# Altium project RUT2CLOUDPrjPcb.PrjPcb (part 2 of 2)

## Sheet BLE_Controller.SchDoc
size A3
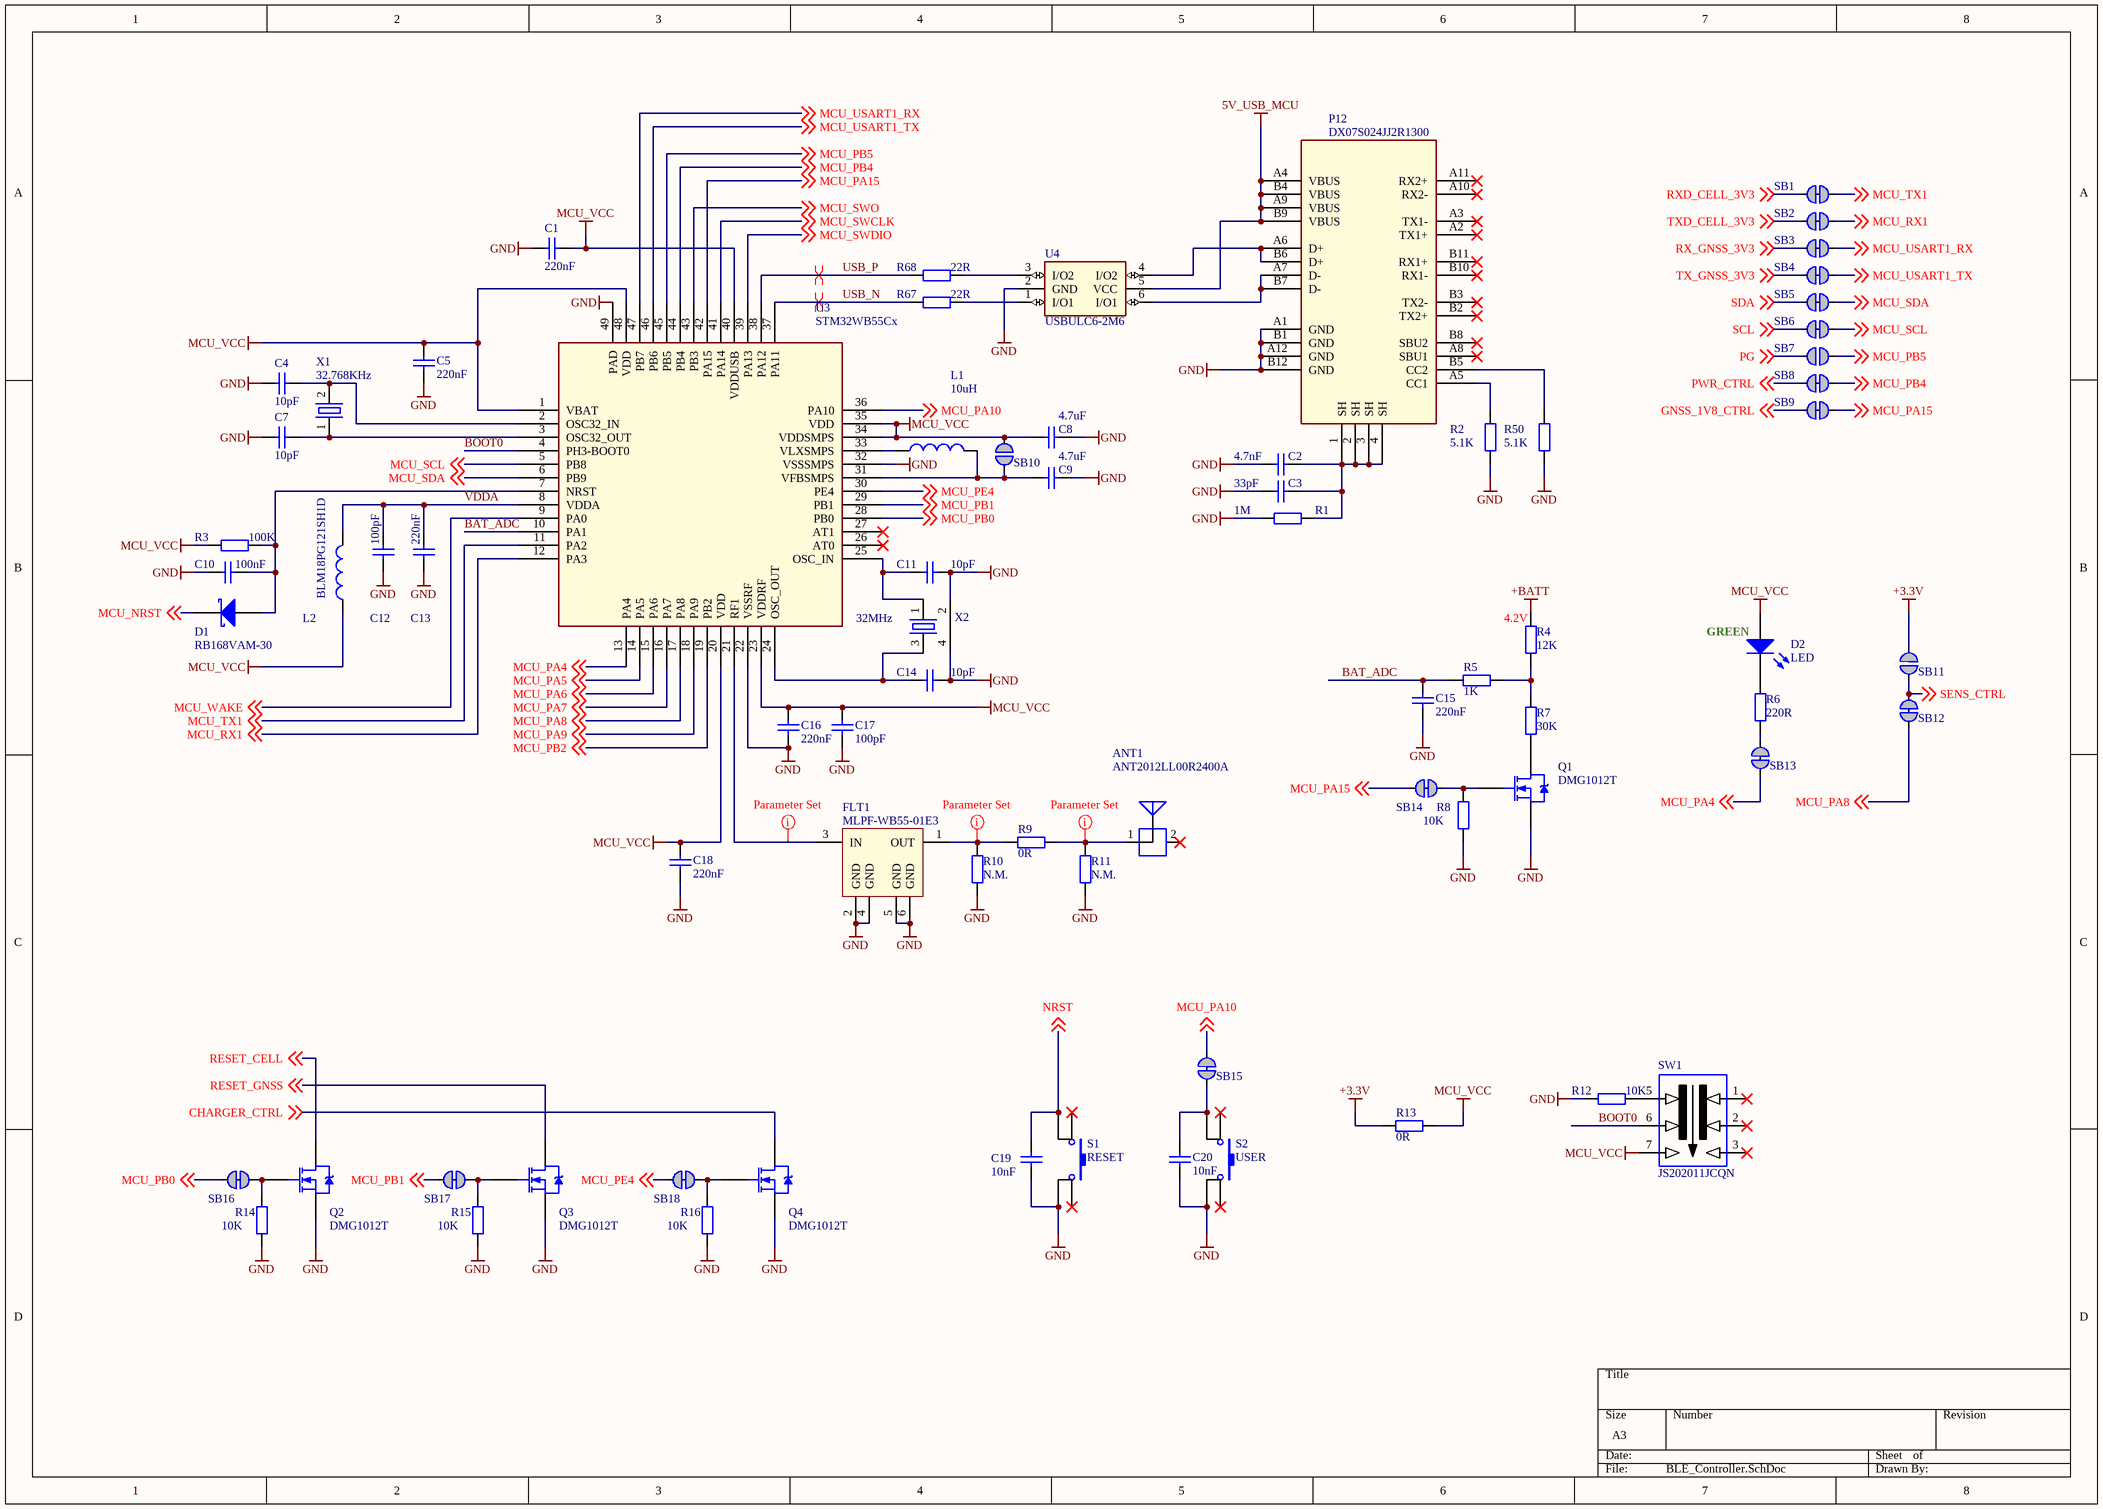
[diagram p5: BLE_Controller.SchDoc]

### Parts
ANT1  ANT2012LL00R2400A  [YEGEO_BT_Antena_0805]
C1  value 220nF  [C0402]  (hidden comment: Cap Semi)
C2  value 4.7nF  [C0402]  (hidden comment: Cap Semi)
C3  value 33pF  [C0402]  (hidden comment: Cap Semi)
C4  value 10pF  [C0402]  (hidden comment: Cap Semi)
C5  value 220nF  [C0402]  (hidden comment: Cap Semi)
C7  value 10pF  [C0402]  (hidden comment: Cap Semi)
C8  value 4.7uF  [C0402]  (hidden comment: Cap Semi)
C9  value 4.7uF  [C0402]  (hidden comment: Cap Semi)
C10  value 100nF  [C0402]  (hidden comment: Cap Semi)
C11  value 10pF  [C0402]  (hidden comment: Cap Semi)
C12  value 100pF  [C0402]  (hidden comment: Cap Semi)
C13  value 220nF  [C0402]  (hidden comment: Cap Semi)
C14  value 10pF  [C0402]  (hidden comment: Cap Semi)
C15  value 220nF  [C0402]  (hidden comment: Cap Semi)
C16  value 220nF  [C0402]  (hidden comment: Cap Semi)
C17  value 100pF  [C0402]  (hidden comment: Cap Semi)
C18  value 220nF  [C0402]  (hidden comment: Cap Semi)
C19  value 10nF  [C0402]  (hidden comment: Cap Semi)
C20  value 10nF  [C0402]  (hidden comment: Cap Semi)
D1  RB168VAM-30  [SOD323]
D2  LED  [PICOLED]
FLT1  MLPF-WB55-01E3  [Bumpless CSP]
L1  value 10uH  [L0805]  (hidden comment: Inductor)
L2  value BLM18PG121SH1D  [L0603]  (hidden comment: Inductor)
P12  DX07S024JJ2R1300  [DX07_USB_C]
Q1  DMG1012T  [SOT-523_custom]
Q2  DMG1012T  [SOT-523_custom]
Q3  DMG1012T  [SOT-523_custom]
Q4  DMG1012T  [SOT-523_custom]
R1  value 1M  [R0402]  (hidden comment: Res2)
R2  value 5.1K  [R0402]  (hidden comment: Res2)
R3  value 100K  [R0402]  (hidden comment: Res2)
R4  value 12K  [R0402]  (hidden comment: Res2)
R5  value 1K  [R0402]  (hidden comment: Res2)
R6  value 220R  [R0402]  (hidden comment: Res2)
R7  value 30K  [R0402]  (hidden comment: Res2)
R8  value 10K  [R0402]  (hidden comment: Res2)
R9  value 0R  [R0402]  (hidden comment: Res2)
R10  value N.M.  [R0402]  (hidden comment: Res2)  (no BOM)
R11  value N.M.  [R0402]  (hidden comment: Res2)  (no BOM)
R12  value 10K  [R0402]  (hidden comment: Res2)
R13  value 0R  [R0402]  (hidden comment: Res2)
R14  value 10K  [R0402]  (hidden comment: Res2)
R15  value 10K  [R0402]  (hidden comment: Res2)
R16  value 10K  [R0402]  (hidden comment: Res2)
R50  value 5.1K  [R0402]  (hidden comment: Res2)
R67  value 22R  [R0402]  (hidden comment: Res2)
R68  value 22R  [R0402]  (hidden comment: Res2)
S1  RESET  [PTS645S_button]
S2  USER  [PTS645S_button]
SB1  Solderbridge  [Solderbridge_Shorted]  (value not drawn)  (net tie, no BOM)
SB2  Solderbridge  [Solderbridge_Shorted]  (value not drawn)  (net tie, no BOM)
SB3  Solderbridge  [Solderbridge_Shorted]  (value not drawn)  (net tie, no BOM)
SB4  Solderbridge  [Solderbridge_Shorted]  (value not drawn)  (net tie, no BOM)
SB5  Solderbridge  [Solderbridge_Shorted]  (value not drawn)  (net tie, no BOM)
SB6  Solderbridge  [Solderbridge_Shorted]  (value not drawn)  (net tie, no BOM)
SB7  Solderbridge  [Solderbridge]  (value not drawn)  (no BOM)
SB8  Solderbridge  [Solderbridge_Shorted]  (value not drawn)  (net tie, no BOM)
SB9  Solderbridge  [Solderbridge_Shorted]  (value not drawn)  (net tie, no BOM)
SB10  Solderbridge  [Solderbridge]  (value not drawn)  (no BOM)
SB11  Solderbridge  [Solderbridge]  (value not drawn)  (no BOM)
SB12  Solderbridge  [Solderbridge_Shorted]  (value not drawn)  (net tie, no BOM)
SB13  Solderbridge  [Solderbridge_Shorted]  (value not drawn)  (net tie, no BOM)
SB14  Solderbridge  [Solderbridge_Shorted]  (value not drawn)  (net tie, no BOM)
SB15  Solderbridge  [Solderbridge_Shorted]  (value not drawn)  (net tie, no BOM)
SB16  Solderbridge  [Solderbridge_Shorted]  (value not drawn)  (net tie, no BOM)
SB17  Solderbridge  [Solderbridge_Shorted]  (value not drawn)  (net tie, no BOM)
SB18  Solderbridge  [Solderbridge_Shorted]  (value not drawn)  (net tie, no BOM)
SW1  JS202011JCQN  [JS202011JCQN]
U3  STM32WB55Cx  [UFQFPN48]
U4  USBULC6-2M6  [Micro_QFN_6L]
X1  32.768KHz  [XTAL_3215]
X2  32MHz  [XTAL_3.5x2.5]

### Nets
5V_USB_MCU: P12.A4(VBUS) P12.A9(VBUS) P12.B4(VBUS) P12.B9(VBUS) U4.5(VCC)
+3.3V: R13.2 SB11.1
+BATT: R4.1
GND: C1.2 C2.1 C3.1 C4.1 C5.1 C7.2 C8.2 C9.2 C10.1 C11.2 C12.1 C13.1 C14.1 C15.2 C16.1 C17.1 C18.1 C19.1 C20.2 FLT1.2(GND) FLT1.4(GND) FLT1.5(GND) FLT1.6(GND) P12.A1(GND) P12.A12(GND) P12.B1(GND) P12.B12(GND) Q1.3(S) Q2.3(S) Q3.3(S) Q4.3(S) R1.1 R2.1 R8.1 R10.2 R11.2 R12.1 R14.1 R15.1 R16.1 R50.1 S1.4 S2.4 U3.22(VSSRF) U3.32(VSSSMPS) U3.49(PAD) U4.2(GND) X2.2 X2.4
MCU_VCC: C1.1 C5.2 C8.1 C16.2 C17.2 C18.2 D2.1(A) L2.1 R3.1 R13.1 SB10.2 SW1.7 U3.1(VBAT) U3.20(VDD) U3.23(VDDRF) U3.34(VDDSMPS) U3.35(VDD) U3.40(VDDUSB) U3.48(VDD)
BAT_ADC: C15.1 R5.1 U3.10(PA1)
BOOT0: SW1.6 U3.4(PH3-BOOT0)
CHARGER_CTRL: Q4.2(D) ; off-sheet CHARGER_CTRL
GNSS_1V8_CTRL: SB9.2 ; off-sheet GNSS_1V8_CTRL
MCU_NRST: D1.2(K) ; off-sheet MCU_NRST
MCU_PA4: SB13.2 U3.13(PA4) ; off-sheet MCU_PA4
MCU_PA5: U3.14(PA5) ; off-sheet MCU_PA5
MCU_PA6: U3.15(PA6) ; off-sheet MCU_PA6
MCU_PA7: U3.16(PA7) ; off-sheet MCU_PA7
MCU_PA8: SB12.1 U3.17(PA8) ; off-sheet MCU_PA8
MCU_PA9: U3.18(PA9) ; off-sheet MCU_PA9
MCU_PA10: SB15.1 U3.36(PA10) ; off-sheet MCU_PA10
MCU_PA15: SB9.1 SB14.2 U3.42(PA15) ; off-sheet MCU_PA15
MCU_PB0: SB16.2 U3.28(PB0) ; off-sheet MCU_PB0
MCU_PB1: SB17.2 U3.29(PB1) ; off-sheet MCU_PB1
MCU_PB2: U3.19(PB2) ; off-sheet MCU_PB2
MCU_PB4: SB8.1 U3.44(PB4) ; off-sheet MCU_PB4
MCU_PB5: SB7.2 U3.45(PB5) ; off-sheet MCU_PB5
MCU_PE4: SB18.2 U3.30(PE4) ; off-sheet MCU_PE4
MCU_RX1: SB2.1 U3.12(PA3) ; off-sheet MCU_RX1
MCU_SCL: SB6.1 U3.5(PB8) ; off-sheet MCU_SCL
MCU_SDA: SB5.1 U3.6(PB9) ; off-sheet MCU_SDA
MCU_SWCLK: U3.41(PA14) ; off-sheet MCU_SWCLK
MCU_SWDIO: U3.39(PA13) ; off-sheet MCU_SWDIO
MCU_SWO: U3.43(PB3) ; off-sheet MCU_SWO
MCU_TX1: SB1.1 U3.11(PA2) ; off-sheet MCU_TX1
MCU_USART1_RX: SB3.1 U3.47(PB7) ; off-sheet MCU_USART1_RX
MCU_USART1_TX: SB4.1 U3.46(PB6) ; off-sheet MCU_USART1_TX
MCU_WAKE: U3.9(PA0) ; off-sheet MCU_WAKE
NRST: C19.2 S1.2 ; off-sheet NRST
PG: SB7.1 ; off-sheet PG
PWR_CTRL: SB8.2 ; off-sheet PWR_CTRL
RESET_CELL: Q2.2(D) ; off-sheet RESET_CELL
RESET_GNSS: Q3.2(D) ; off-sheet RESET_GNSS
RX_GNSS_3V3: SB3.2 ; off-sheet RX_GNSS_3V3
RXD_CELL_3V3: SB1.2 ; off-sheet RXD_CELL_3V3
SCL: SB6.2 ; off-sheet SCL
SDA: SB5.2 ; off-sheet SDA
SENS_CTRL: SB11.2 SB12.2 ; off-sheet SENS_CTRL
TX_GNSS_3V3: SB4.2 ; off-sheet TX_GNSS_3V3
TXD_CELL_3V3: SB2.2 ; off-sheet TXD_CELL_3V3
USB_N: R67.2 U3.37(PA11)
USB_P: R68.2 U3.38(PA12)
VDDA: C12.2 C13.2 L2.2 U3.8(VDDA)
NetANT1_1: ANT1.1 R9.1 R11.1
NetC2_2: C2.2 C3.2 P12.1(SH) P12.2(SH) P12.3(SH) P12.4(SH) R1.2
NetC4_2: C4.2 U3.2(OSC32_IN) X1.2
NetC7_1: C7.1 U3.3(OSC32_OUT) X1.1
NetC9_1: C9.1 L1.2 SB10.1 U3.31(VFBSMPS)
NetC10_2: C10.2 D1.1(A) R3.2 U3.7(NRST)
NetC11_1: C11.1 U3.25(OSC_IN) X2.1
NetC14_2: C14.2 U3.24(OSC_OUT) X2.3
NetC20_1: C20.1 S2.2 SB15.2
NetD2_2: D2.2(K) R6.1
NetFLT1_1: FLT1.1(OUT) R9.2 R10.1
NetFLT1_3: FLT1.3(IN) U3.21(RF1)
NetL1_1: L1.1 U3.33(VLXSMPS)
NetP12_A5: P12.A5(CC1) R2.2
NetP12_A6: P12.A6(D+) P12.B6(D+) U4.4(I/O2)
NetP12_A7: P12.A7(D-) P12.B7(D-) U4.6(I/O1)
NetP12_B5: P12.B5(CC2) R50.2
NetQ1_1: Q1.1(G) R8.2 SB14.1
NetQ1_2: Q1.2(D) R7.2
NetQ2_1: Q2.1(G) R14.2 SB16.1
NetQ3_1: Q3.1(G) R15.2 SB17.1
NetQ4_1: Q4.1(G) R16.2 SB18.1
NetR4_2: R4.2 R5.2 R7.1
NetR6_2: R6.2 SB13.1
NetR12_2: R12.2 SW1.5
NetR67_1: R67.1 U4.1(I/O1)
NetR68_1: R68.1 U4.3(I/O2)

Not connected (* = marked no-connect by the designer): ANT1 2*; P12 A2(TX1+)* A3(TX1-)* A8(SBU1)* A10(RX2-)* A11(RX2+)* B2(TX2+)* B3(TX2-)* B8(SBU2)* B10(RX1-)* B11(RX1+)*; S1 1* 3*; S2 1* 3*; SW1 1* 2* 3*; U3 26(AT0)* 27(AT1)*

### Layout directives
differential pair: USB_N, USB_P
rule Clearance Constraint [Clearance = 0.106mm]; rule Width Constraint [Pref Width = 0.45mm    Min Width = 0.45mm    Max Width = 4mm]: NetANT1_1, NetFLT1_1
rule Clearance Constraint [Clearance = 0.104mm]; rule Width Constraint [Pref Width = 0.2mm    Min Width = 0.2mm    Max Width = 0.2mm]: NetFLT1_3

### Notes on the sheet
- (near R4) 4.2V
- (near D2) GREEN

### Library data of the parts
ANT1 = Antenna: Generic Antenna; Manufacturer: YAGEO; Part Description: Ceramic Chip Antenna; Specification: 2.4 – 2.5 GHZ; Manufacturer Part No.: ANT2012LL00R2400A; Supplier: Rutronik; Supplier part number: WIREAC1413; Value: ANT2012LL00R2400A; Link: https://www.rutronik24.com/product/yageo/ant2012ll00r2400a/42235.html
C1-C5 C7-C14 C16-C18 = Cap Semi: Capacitor (Semiconductor SIM Model); Manufacturer: YAGEO; Manufacturer Part No.: CC0402JRNPO9BN100; Part Description: Ceramic Capacitor; Specification: NP0, 6.3V, 5%; Supplier: Rutronik; Supplier part number: KKK14556; Link: https://www.rutronik24.com/product/yageo/cc0402jrnpo9bn100/29735.html
C15 = Cap Semi: Capacitor (Semiconductor SIM Model); Manufacturer: YAGEO; Manufacturer Part No.: CC0402KRX5R5BB224; Part Description: Ceramic Capacitor; Specification: X5R, 6.3V, 10%; Supplier: Rutronik; Supplier part number: KKK23148; Link: https://www.rutronik24.com/product/yageo/cc0402krx5r5bb224/3611951.html
C19 C20 = Cap Semi: Capacitor (Semiconductor SIM Model); Manufacturer: Samsung Electronics; Manufacturer Part No.: CL05B103KB5NNNC; Part Description: Ceramic Capacitor; Specification: X5R, 6.3V, 10%; Supplier: Rutronik; Supplier part number: KKK21418; Link: https://www.rutronik24.com/product/samsung+em/cl05b103kb5nnnc/6075254.html
D1 = D Schottky: Schottky Diode; Manufacturer: ROHM; Part Description: Low VF Schottky Barrier Rectifier; Specification: 30V, 1A; Manufacturer Part No.: RB168VAM-30; Supplier: Rutronik; Supplier part number: RB168VAM-30; Value: RB168VAM-30; Link: http://rohmfs.rohm.com/en/products/databook/datasheet/discrete/diode/schottky_barrier/rb168vam-30tr-e.pdf
D2 = LED2: Typical SMD LED; Manufacturer: ROHM; Manufacturer Part No.: SML-P13PTT86R; Specification: Green, 20mA; Value: SML-P13PTT86R; Supplier: Rutronik; Supplier part number: LED26047; Part Description: Typical SMD LED; Link: https://www.rutronik24.com/product/rohm/sml-p13ptt86r/11064312.html
FLT1 = MLPF-WB55-01E3: 2.4 GHz low pass filter matched to STM32WB55Cx/Rx; Manufacturer: STMicroelectronics; Specification: 2.4GHz, CSP; Link: https://www.digikey.com/product-detail/en/stmicroelectronics/MLPF-WB55-01E3/497-19088-1-ND/10057128; Manufacturer Part No.: MLPF-WB55-01E3; Part Description: 2.4 GHz low pass filter; Supplier: Digi-Key; Supplier part number: 497-19088-1-ND; Value: MLPF-WB55-01E3
L1 = Inductor: Manufacturer: muRata; Manufacturer Part No.: LQM21FN100M70L; Specification: 100mA; Supplier: Rutronik; Supplier part number: IND8474; Part Description: Inductor; Link: https://www.rutronik24.com/product/murata/lqm21fn100m70l/25672.html
L2 = Inductor: Manufacturer: muRata; Part Description: Ferrite Bead; Specification: 120R, 2A; Manufacturer Part No.: BLM18PG121SH1D; Supplier: Rutronik; Supplier part number: FE3867; Link: https://www.rutronik24.com/product/murata/blm18pg121sh1d/5885588.html
P12 = DX07S024JJ2R1300: 24P USB C DUAL SMT ON BOARD; Manufacturer: JAE; Specification: Type C; Link: https://www.rutronik24.com/product/jae/dx07s024jj2r1300/8301548.html; Manufacturer Part No.: DX07S024JJ2R1300; Part Description: 24P USB C DUAL SMT ON BOARD; Supplier: Rutronik; Supplier part number: CONIO1808; Value: DX07S024JJ2R1300
Q1-Q4 = NMOS-2: N-Channel Power MOSFET; Manufacturer: Diodes Inc.; Manufacturer Part No.: DMG1012T-7; Part Description: N-Channel MOSFET; Specification: 20V, 0.63A; Value: DMG1012T-7; Supplier: Rutronik; Supplier part number: TMOSS6623; Link: https://www.rutronik24.com/product/diodes+inc/dmg1012t-7/5168665.html
R1 R9-R11 R13 = Res2: Manufacturer: YAGEO; Manufacturer Part No.: RC0402FR-070RL; Part Description: Thick Film Resistor; Specification: 5% 0,063W; Supplier: Rutronik; Supplier part number: WRC53079; Link: https://www.rutronik24.com/product/yageo/rc0402fr-070rl/5183530.html
R2 R3 R8 R12 R14-R16 R50 R67 R68 = Res2: Manufacturer: ASJ; Manufacturer Part No.: CR10-103-JK; Part Description: Thick Film Resistor; Specification: 5% 0,063W; Supplier: Rutronik; Supplier part number: WRC40976; Link: https://www.rutronik24.com/product/asj/cr10-103-jk/54295.html
R4 = Res2: Manufacturer: ASJ; Manufacturer Part No.: CR10-105-JK; Part Description: Thick Film Resistor; Specification: 5% 0,063W; Supplier: Rutronik; Supplier part number: WRC35254; Link: https://www.rutronik24.com/product/asj/cr10-105-jk/51971.html
R5 = Res2: Manufacturer: ASJ; Manufacturer Part No.: CR10-102-JK; Part Description: Thick Film Resistor; Specification: 5% 0,063W; Supplier: Rutronik; Supplier part number: WRC41426; Link: https://www.rutronik24.com/product/asj/cr10-102-jk/54392.html
R6 = Res2: Manufacturer: ASJ; Manufacturer Part No.: CR10-221-JK; Part Description: Thick Film Resistor; Specification: 5% 0,063W; Supplier: Rutronik; Supplier part number: WRC35108; Link: https://www.rutronik24.com/product/asj/cr10-221-jk/51883.html
R7 = Res2: Manufacturer: YAGEO; Manufacturer Part No.: RC0402JR-07390KL; Part Description: Thick Film Resistor; Specification: 5% 0,063W; Supplier: Rutronik; Supplier part number: WRC33888; Link: https://www.rutronik24.com/product/yageo/rc0402jr-07390kl/51055.html
S1 S2 = SW-PB: Switch; Manufacturer: C&K; Manufacturer Part No.: PTS645SM43SMTR92 LFS; Part Description: Tactile Button; Specification: 1.6N, Straight, SMT; Value: PTS645SM43SMTR92 LFS; Supplier: Rutronik; Supplier part number: SWITCH8818; Link: https://www.rutronik24.com/product/c%26k/pts645sm43smtr92+lfs/3580965.html
SB1-SB6 SB8 SB9 SB12-SB18 = Solderbridge Shorted: Manufacturer: *; Value: Solderbridge; Supplier: *; Supplier part number: *
SW1 = JS202011JCQN: Sub-Miniature Slide Switch, VERTICAL MOUNT SMT - J BEND; Manufacturer: CK Switches; Specification: 6V DC, 0.3A; Link: https://www.ckswitches.com/media/1422/js.pdf; Manufacturer Part No.: JS202011JCQN; Part Description: VERTICAL MOUNT SMT - J BEND; Supplier: Rutronik; Supplier part number: SWITCH10809; Value: JS202011JCQN
U3 = STM32WBxx_QFN48: Multiprotocol wireless 32-bit MCU Arm®-based Cortex®-M4 / with FPU, Bluetooth® 5 and 802.15.4 radio solution; Manufacturer: STMicroelectronics; Manufacturer Part No.: STM32WB55CGU6; Specification: 1MB Flash, 256K BRAM; Value: STM32WB55CGU6; Link: https://www.st.com/en/microcontrollers-microprocessors/stm32wb55cg.html; Part Description: Multiprotocol wireless 32-bit MCU Arm®-based Cortex®-M4  with FPU, Bluetooth® 5 and 802.15.4 radio solution; Supplier: Rutronik; Supplier part number: STM32WB55CGU6
U4 = USBULC6-2M6: Ultra large bandwidth ESD protection; Manufacturer: STMicroelectronics; Specification: 6V, 0.6pF; Link: https://www.rutronik24.com/product/st/usbulc6-2m6/3623499.html; Manufacturer Part No.: USBULC6-2M6; Part Description: Ultra large bandwidth ESD protection; Supplier: Rutronik; Supplier part number: DTRL11259; Value: USBULC6-2M6
X1 = XTL-000011-01: Manufacturer: Epson Electronics; Manufacturer Part No.: FC-135 32.7680KA-AC3; Part Description: XTAL 3.2x1.5mm; Specification: 32.768 kHz, 9pF, 20ppm; Value: FC-135 32.7680KA-AC3; Supplier: Rutronik; Supplier part number: QUARZ6279; Link: https://www.rutronik24.com/product/epson/fc-135r+32%2C768khz++9pf++20ppm+++rohsconf/5825395.html
X2 = XTL-000011-01: Manufacturer: Kyocera; Manufacturer Part No.: CX3225SB32000D0FLJCC; Part Description: XTAL 3.2x2.5mm; Specification: 32MHz, 8pF, 15ppm; Value: CX3225SB32000D0FLJCC; Supplier: Rutronik; Supplier part number: CX3225SB32000D0FLJCC; Link: https://global.kyocera.com/prdct/electro/product/crystal-device/xtal/
SB7 SB10 SB11 = Solderbridge: Manufacturer: *; Value: Solderbridge; Supplier: *; Supplier part number: *

## Nets that join several sheets
1V8: Modem GNSS (13 pins), Connectors (P5.29)
3.3V_AUX: Power management (R34.1), Connectors (P2.4)
3V3_STLINK: Power management (C56.1 U14.A2), ST Link (18 pins)
5V_AUX: Power management (R36.2), Connectors (P2.5)
5V_USB_MCU: Power management (SW2.3 SW2.7), BLE_Controller (5 pins)
5V_USB_STLINK: Power management (5 pins), ST Link (6 pins)
+3.3V: Modem GNSS (12 pins), Power management (R23.2 R33.1 R34.2), Connectors (P1.8), ST Link (R60.2), BLE_Controller (R13.2 SB11.1)
+5V_USB: Power management (19 pins), ST Link (D7.1)
+BATT: Power management (5 pins), BLE_Controller (R4.1)
+PWR: Modem GNSS (C26.2 L3.2), Power management (Q10.1)
GND: Modem GNSS (56 pins), Power management (38 pins), Sensors (12 pins), Connectors (22 pins), ST Link (33 pins), BLE_Controller (49 pins)
GNSS_1V8: Modem GNSS (9 pins), Power management (C54.1 L4.2)
1PPS_OUT: Modem GNSS (U2.8), Connectors (P5.10)
ACC_INT1: Sensors (U16.12), Connectors (P6.12)
ACC_INT2: Sensors (U16.11), Connectors (P6.10)
ADC1: Modem GNSS (U1.13), Connectors (P4.3)
ADC2: Modem GNSS (U1.14), Connectors (P4.4)
AMB_INT: Sensors (U17.2), Connectors (P6.8)
BOOT_GNSS: Modem GNSS (U2.4), Connectors (P5.4)
CHARGER_CTRL: Power management (U11.7), Connectors (P5.24), BLE_Controller (Q4.2)
CHARGER_STAT1: Power management (SB32.2 U11.4), Connectors (P5.36)
CHARGER_STAT2: Power management (SB31.2 U11.3), Connectors (P5.38)
CTS_CELL_3V3: Modem GNSS (U8.4), Connectors (P5.30)
DCD_CELL: Modem GNSS (U1.1), Connectors (P5.7)
DSR_CELL: Modem GNSS (U1.3), Connectors (P5.3)
DTR_CELL: Modem GNSS (U1.4), Connectors (P5.18)
EAR_N: Modem GNSS (U1.20), Connectors (P5.33)
EAR_P: Modem GNSS (U1.21), Connectors (P5.35)
GNSS_1V8_CTRL: Power management (Q6.1 R35.2), Connectors (P3.6 P5.20), BLE_Controller (SB9.2)
IO1_CELL: Modem GNSS (SB21.1 U1.42), Connectors (P5.21)
IO2_CELL: Modem GNSS (SB20.1 U1.41), Connectors (P5.19)
IO3_CELL: Modem GNSS (U1.40), Connectors (P5.17)
IO4_CELL: Modem GNSS (U1.39), Connectors (SB45.2)
IO5_CELL: Modem GNSS (U1.29), Connectors (P5.15)
IO6_CELL: Modem GNSS (U1.28), Connectors (P5.13)
IO7_CELL: Modem GNSS (U1.27), Connectors (P5.11)
IO8_CELL: Modem GNSS (U1.26), Connectors (P5.9)
IOA_GNSS: Modem GNSS (U2.23), Connectors (P5.12)
LDO_CTRL: Power management (R24.1 U12.5), Connectors (P5.26)
MCU_NRST: Connectors (SB48.1), BLE_Controller (D1.2)
MCU_PA4: Connectors (P6.34), BLE_Controller (SB13.2 U3.13)
MCU_PA5: Connectors (P1.5), BLE_Controller (U3.14)
MCU_PA6: Connectors (P1.4), BLE_Controller (U3.15)
MCU_PA7: Connectors (P1.3), BLE_Controller (U3.16)
MCU_PA8: Connectors (P6.28), BLE_Controller (SB12.1 U3.17)
MCU_PA9: Connectors (P4.1), BLE_Controller (U3.18)
MCU_PA10: Connectors (P6.32), BLE_Controller (SB15.1 U3.36)
MCU_PA15: Connectors (P6.30), BLE_Controller (SB9.1 SB14.2 U3.42)
MCU_PB0: Connectors (P3.3), BLE_Controller (SB16.2 U3.28)
MCU_PB1: Connectors (P3.4), BLE_Controller (SB17.2 U3.29)
MCU_PB2: Connectors (P1.2), BLE_Controller (U3.19)
MCU_PB4: Connectors (P1.1), BLE_Controller (SB8.1 U3.44)
MCU_PB5: Connectors (P6.18), BLE_Controller (SB7.2 U3.45)
MCU_PE4: Connectors (P3.5), BLE_Controller (SB18.2 U3.30)
MCU_RX1: Connectors (P3.1 P6.24), ST Link (SB37.1), BLE_Controller (SB2.1 U3.12)
MCU_SCL: Connectors (P6.22), BLE_Controller (SB6.1 U3.5)
MCU_SDA: Connectors (P6.20), BLE_Controller (SB5.1 U3.6)
MCU_SWCLK: Connectors (SB49.2), BLE_Controller (U3.41)
MCU_SWDIO: Connectors (SB46.2), BLE_Controller (U3.39)
MCU_SWO: Connectors (SB47.2), BLE_Controller (U3.43)
MCU_TX1: Connectors (P3.2 P6.26), ST Link (SB38.1), BLE_Controller (SB1.1 U3.11)
MCU_USART1_RX: Connectors (P6.14), BLE_Controller (SB3.1 U3.47)
MCU_USART1_TX: Connectors (P6.16), BLE_Controller (SB4.1 U3.46)
MCU_WAKE: Connectors (P4.2), BLE_Controller (U3.9)
MIC_N: Modem GNSS (U1.22), Connectors (P5.37)
MIC_P: Modem GNSS (U1.24), Connectors (P5.39)
NRST: Connectors (P6.1 SB19.1 SB48.2), ST Link (SB39.2), BLE_Controller (C19.2 S1.2)
ON_OFF_GNSS: Modem GNSS (SB20.2 SB24.1 U2.7), Connectors (P5.6)
PG: Power management (R23.1 U12.4), Connectors (P1.6), BLE_Controller (SB7.1)
PWM_DAC: Modem GNSS (U1.15), Connectors (P5.40)
PWR_CTRL: Power management (Q11.1 R41.2), Connectors (P3.7 P5.22), BLE_Controller (SB8.2)
PWR_ENn: Connectors (P6.3), ST Link (U20.28)
RESET_CELL: Modem GNSS (U1.47), Connectors (P5.1), BLE_Controller (Q2.2)
RESET_GNSS: Modem GNSS (U2.1), Connectors (P5.2), BLE_Controller (Q3.2)
RING_CELL: Modem GNSS (U1.2), Connectors (P5.5)
RTS_CELL_3V3: Modem GNSS (U6.4), Connectors (P5.28)
RX1_GNSS: Modem GNSS (U2.19), Connectors (P5.16)
RX_GNSS_3V3: Modem GNSS (U10.4), Connectors (P5.34), BLE_Controller (SB3.2)
RXD_CELL_3V3: Modem GNSS (U7.4), BLE_Controller (SB1.2)
RXDAUX_CELL: Modem GNSS (SB22.1 U1.44), Connectors (P5.25)
SCL: Sensors (R43.2 U16.1 U17.6 U18.4), Connectors (P1.10 P6.9), BLE_Controller (SB6.2)
SDA: Sensors (R42.2 U16.4 U17.4 U18.3), Connectors (P1.9 P6.7), BLE_Controller (SB5.2)
SENS_CTRL: Sensors (5 pins), Connectors (P6.11), BLE_Controller (SB11.2 SB12.2)
SYSTEM_ON_GNSS: Modem GNSS (SB21.2 U2.22), Connectors (P5.8)
T_SWCLK: Connectors (P6.6 SB49.1), ST Link (SB40.1)
T_SWDIO: Connectors (P6.2 SB46.1), ST Link (SB42.1)
T_SWO: Connectors (P6.4 SB47.1), ST Link (SB41.1)
TX1_GNSS: Modem GNSS (U2.21), Connectors (P5.14)
TX_GNSS_3V3: Modem GNSS (SB29.2), Connectors (P5.32), BLE_Controller (SB4.2)
TXD_CELL_3V3: Modem GNSS (SB27.1), BLE_Controller (SB2.2)
TXDAUX_CELL: Modem GNSS (SB23.1 U1.45), Connectors (P5.23)
VRTC: Modem GNSS (U1.30), Connectors (P5.31)